# Altium schematic sheet Power.SchDoc
size A
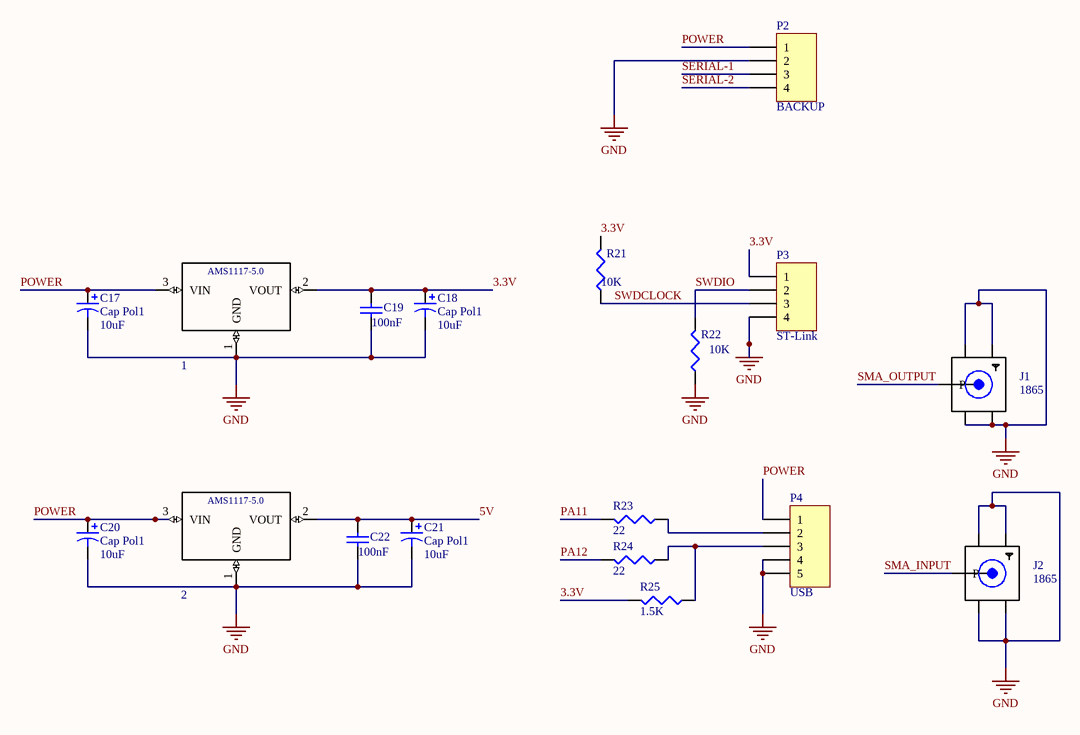
[diagram p0: Power.SchDoc]

## Parts
1  AMS1117-3.3  [SOT223]  (value not drawn)
2  AMS1117-5.0  [SOT223]  (value not drawn)
C17  Cap Pol1  value 10uF  [RAD-0.2]
C18  Cap Pol1  value 10uF  [RAD-0.2]
C19  value 100nF  [1608[0603]]  (hidden comment: Cap Semi)
C20  Cap Pol1  value 10uF  [RAD-0.2]
C21  Cap Pol1  value 10uF  [RAD-0.2]
C22  value 100nF  [1608[0603]]  (hidden comment: Cap Semi)
J1  1865  [ADAFRUIT_1865_1865(Primary)]
J2  1865  [ADAFRUIT_1865_1865(Primary)]
P2  BACKUP  [MOLEX KK 0022272041]
P3  ST-Link  [MOLEX KK 0022272041]
P4  USB  [FCI USB 10033526-N3212LF]
R21  value 10K  [J1-0603]  (hidden comment: Res3)
R22  value 10K  [J1-0603]  (hidden comment: Res3)
R23  value 22  [J1-0603]  (hidden comment: Res3)
R24  value 22  [J1-0603]  (hidden comment: Res3)
R25  value 1.5K  [J1-0603]  (hidden comment: Res3)

## Nets
GND: 1.1(GND) 2.1(GND) C17.2 C18.2 C19.1 C20.2 C21.2 C22.1 J1.GND1 J1.GND2 J1.GND3 J1.GND4 J2.GND1 J2.GND2 J2.GND3 J2.GND4 P2.2 P3.4 P4.4 P4.5 R22.1
3.3V: 1.2(VOUT) C18.1 C19.2 P3.1 R21.2 R25.2
5V: 2.2(VOUT) C21.1 C22.2
PA11: R23.2
PA12: R24.2
POWER: 1.3(VIN) 2.3(VIN) C17.1 C20.1 P2.1 P4.1
SERIAL-1: P2.3
SERIAL-2: P2.4
SMA_INPUT: J2.P
SMA_OUTPUT: J1.P
SWDCLOCK: P3.3 R21.1
SWDIO: P3.2 R22.2
NetP4_2: P4.2 R23.1
NetP4_3: P4.3 R24.1 R25.1

## Library data of the parts
1 2 = AMS1117-5.0: Sot-223; MF: ams; MP: AMS1117-5.0; Availability: Unavailable; Price: 0.10 USD; Package: SOT-223 ams; Value: *
C17 C18 C20 C21 = Cap Pol1: Polarized Capacitor (Radial); Published: 8-Jun-2000; LatestRevisionDate: 17-Jul-2002; LatestRevisionNote: Re-released for DXP Platform.; PackageReference: RB7.6-15; Publisher: Altium Limited; PackageDescription: Polarized Capacitor (Radial); 2 Leads
C19 C22 = Cap Semi: Capacitor (Semiconductor SIM Model); Published: 8-Jun-2000; LatestRevisionDate: 29-May-2009; LatestRevisionNote: IPC-7351 Footprint Added.; PackageReference: C1206; Publisher: Altium Limited; PackageDescription: Chip Capacitor
J1 J2 = 1865: ROUND STANDOFF 4-40 BRASS 5/8; MF: Keystone; Availability: Bad; MP: 1865; Price: 2.41 USD; Package: None; Value: *
P2 P3 = Header 4: Header, 4-Pin; LatestRevisionDate: 17-Jul-2002; LatestRevisionNote: Re-released for DXP Platform.; Publisher: Altium Limited
P4 = Header 5: Header, 5-Pin; pin to pad: 1>5 2>4 4>2 5>1; LatestRevisionDate: 17-Jul-2002; LatestRevisionNote: Re-released for DXP Platform.; Publisher: Altium Limited
R21-R25 = Res3: Resistor; Published: 8-Jun-2000; LatestRevisionDate: 29-May-2009; LatestRevisionNote: IPC-7351 Footprint Added.; PackageReference: J1-0603; Publisher: Altium Limited; PackageDescription: Chip Resistor